# Altium schematic sheet top.SchDoc
size A4
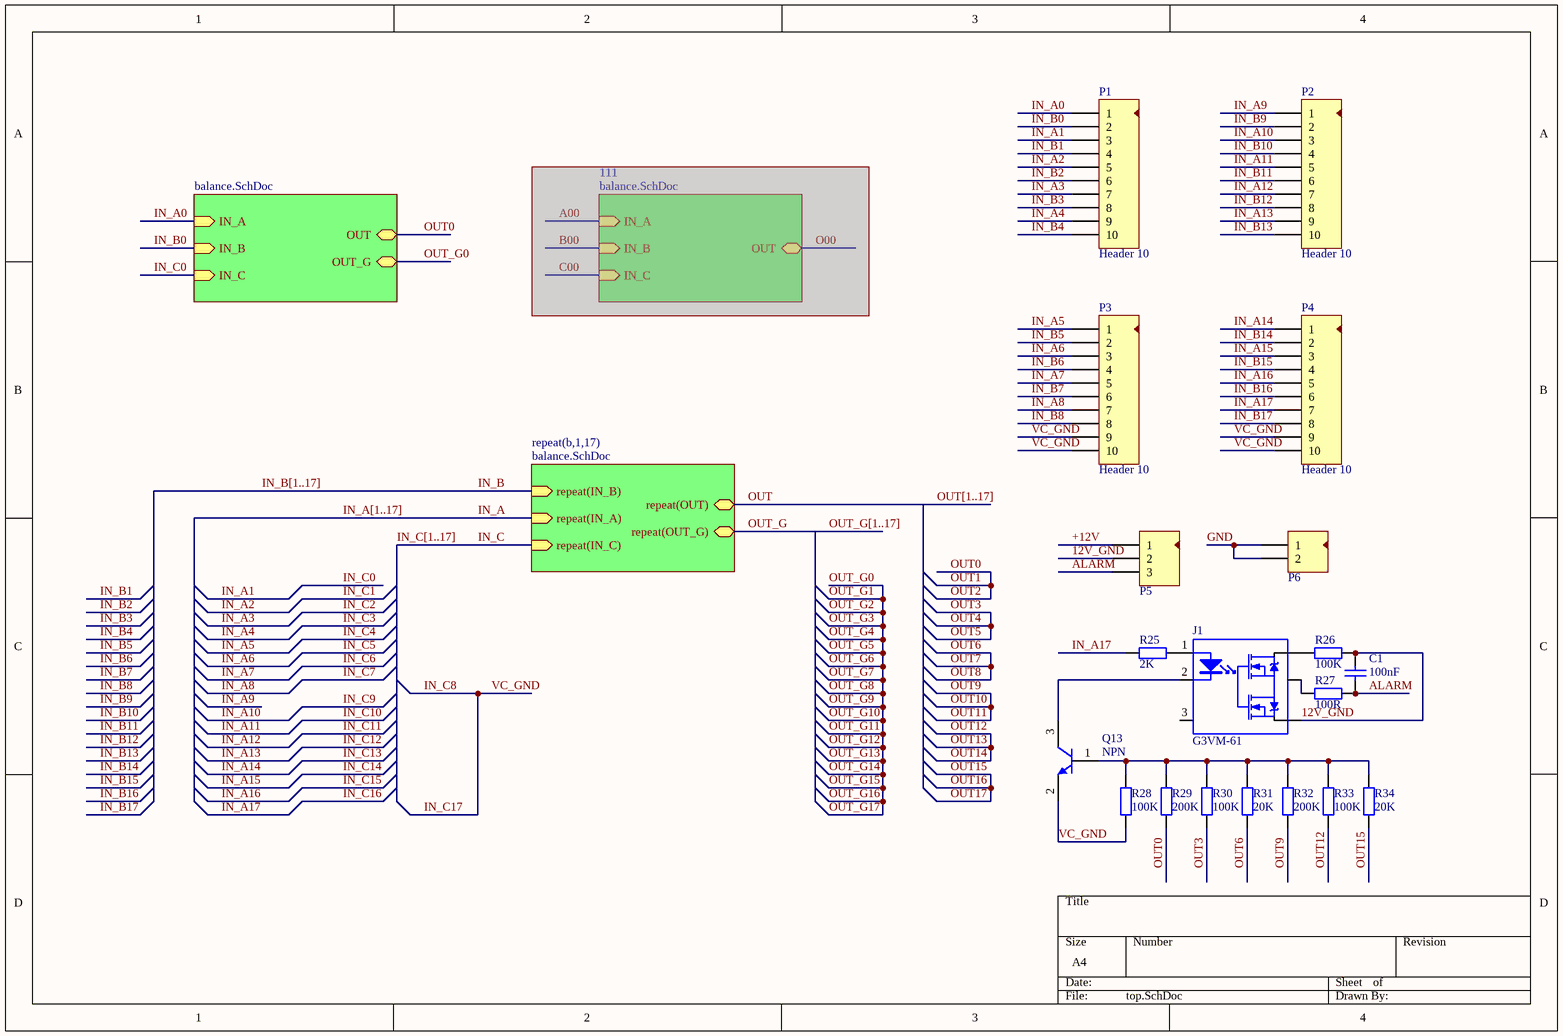
[diagram p0: top.SchDoc]

## Parts
C1  value 100nF  [C-0603]  (hidden comment: Cap-S)
J1  G3VM-61  [DIP-6]
P1  Header 10  [HDR10X1-2.54]
P2  Header 10  [HDR10X1-2.54]
P3  Header 10  [HDR10X1-2.54]
P4  Header 10  [HDR10X1-2.54]
P5  Header 3  [HDR3X1-2.54]  (value not drawn)
P6  Header 2  [HDR2X1-2.54]  (value not drawn)
Q13  NPN  [SOT23-3]
R25  value 2K  [0603-1]  (hidden comment: Res1)
R26  value 100K  [0603-1]  (hidden comment: Res1)
R27  value 100R  [0603-1]  (hidden comment: Res1)
R28  value 100K  [0603-1]  (hidden comment: Res1)
R29  value 200K  [0603-1]  (hidden comment: Res1)
R30  value 100K  [0603-1]  (hidden comment: Res1)
R31  value 20K  [0603-1]  (hidden comment: Res1)
R32  value 200K  [0603-1]  (hidden comment: Res1)
R33  value 100K  [0603-1]  (hidden comment: Res1)
R34  value 20K  [0603-1]  (hidden comment: Res1)

## Sub-sheets
111 = balance.SchDoc (masked out): IN_A (in), IN_B (in), IN_C (in), OUT (bidir)
repeat(b,1,17) = balance.SchDoc: repeat(IN_B) (in), repeat(IN_A) (in), repeat(IN_C) (in), repeat(OUT) (bidir), repeat(OUT_G) (bidir)
? = balance.SchDoc: IN_A (in), IN_B (in), IN_C (in), OUT (bidir), OUT_G (bidir)

## Nets
12V_GND: C1.2 J1.4 P5.2 R26.2
+12V: P5.1
ALARM: C1.1 P5.3 R27.2
GND: P6.1 P6.2
IN_A: sheet repeat(b,1,17)/repeat(IN_A)
IN_A0: P1.1 ; sheet /IN_A
IN_A1: P1.3 ; sheet /IN_C  [also labelled IN_C0]
IN_A2: P1.5  [also labelled IN_C1]
IN_A3: P1.7  [also labelled IN_C2]
IN_A4: P1.9  [also labelled IN_C3]
IN_A5: P3.1  [also labelled IN_C4]
IN_A6: P3.3  [also labelled IN_C5]
IN_A7: P3.5  [also labelled IN_C6]
IN_A8: P3.7  [also labelled IN_C7]
IN_A9: P2.1
IN_A10: P2.3  [also labelled IN_C9]
IN_A11: P2.5  [also labelled IN_C10]
IN_A12: P2.7  [also labelled IN_C11]
IN_A13: P2.9  [also labelled IN_C12]
IN_A14: P4.1  [also labelled IN_C13]
IN_A15: P4.3  [also labelled IN_C14]
IN_A16: P4.5  [also labelled IN_C15]
IN_A17: P4.7 R25.1  [also labelled IN_C16]
IN_B: sheet repeat(b,1,17)/repeat(IN_B)
IN_B0: P1.2 ; sheet /IN_B
IN_B1: P1.4
IN_B2: P1.6
IN_B3: P1.8
IN_B4: P1.10
IN_B5: P3.2
IN_B6: P3.4
IN_B7: P3.6
IN_B8: P3.8
IN_B9: P2.2
IN_B10: P2.4
IN_B11: P2.6
IN_B12: P2.8
IN_B13: P2.10
IN_B14: P4.2
IN_B15: P4.4
IN_B16: P4.6
IN_B17: P4.8
IN_C: sheet repeat(b,1,17)/repeat(IN_C)
IN_C17: P3.9 P3.10 P4.9 P4.10 Q13.2(E) R28.1  [also labelled IN_C8, VC_GND]
OUT: sheet repeat(b,1,17)/repeat(OUT)
OUT0: R29.1 ; sheet /OUT  [also labelled OUT1, OUT2]
OUT3: R30.1  [also labelled OUT4, OUT5]
OUT6: R31.1  [also labelled OUT7, OUT8]
OUT10: R32.1  [also labelled OUT11, OUT9]
OUT12: R33.1  [also labelled OUT13, OUT14]
OUT15: R34.1  [also labelled OUT16, OUT17]
OUT_G: sheet repeat(b,1,17)/repeat(OUT_G)
OUT_G0: sheet /OUT_G  [also labelled OUT_G1, OUT_G10, OUT_G11, OUT_G12, OUT_G13, OUT_G14, OUT_G15, OUT_G16, OUT_G17, OUT_G2, OUT_G3, OUT_G4, OUT_G5, OUT_G6, OUT_G7, OUT_G8, OUT_G9]
NetJ1_1: J1.1(A) R25.2
NetJ1_2: J1.2(K) Q13.3(C)
NetJ1_5: J1.5 R27.1
NetJ1_6: J1.6 R26.1
NetQ13_1: Q13.1(B) R28.2 R29.2 R30.2 R31.2 R32.2 R33.2 R34.2

Not connected (* = marked no-connect by the designer): J1 3

## Buses and harness runs
bus IN_A[1..17]
bus IN_B[1..17]
bus IN_C[1..17]
bus OUT[1..17]
bus OUT_G[1..17]

## Library data of the parts
C1 = Cap-S: 贴片瓷片电容; Published: 8-Jun-2000; LatestRevisionDate: 17-Jul-2002; LatestRevisionNote: Re-released for DXP Platform.; PackageReference: RAD-0.3; Publisher: Altium Limited
J1 = G3VM-61: 固态继电器
P1-P4 = Header 10: 接插件; LatestRevisionDate: 17-Jul-2002; LatestRevisionNote: Re-released for DXP Platform.; Publisher: Altium Limited
P5 = Header 3: 接插件; LatestRevisionDate: 17-Jul-2002; LatestRevisionNote: Re-released for DXP Platform.; Publisher: Altium Limited
P6 = Header 2: 接插件; LatestRevisionDate: 17-Jul-2002; LatestRevisionNote: Re-released for DXP Platform.; Publisher: Altium Limited
Q13 = NPN1: 贴片三极管; Published: 8-Jun-2000; LatestRevisionDate: 15-Jan-2003; LatestRevisionNote: PCB Footprint 'BCY-W3/D4.7' replaced; DatasheetDocument: 1997; PackageDocument: Sep-1998; PackageReference: TO-92A; Publisher: Altium Limited; Code_JEDEC: TO-92A; ComponentLink1Description: Manufacturer Link; ComponentLink1URL: http://www.fairchildsemi.com/; ComponentLink2Description: Datasheet; ComponentLink2URL: http://www.fairchildsemi.com/ds/2N%2F2N3904.pdf
R25-R34 = Res1: 贴片电阻; Published: 8-Jun-2000; LatestRevisionDate: 17-Jul-2002; LatestRevisionNote: Re-released for DXP Platform.; PackageReference: AXIAL-0.4; Publisher: Altium Limited